# Altium project Rear.PrjPCB (part 2 of 2)

## Sheet Connectors.SchDoc
size A; SheetNumber: 13
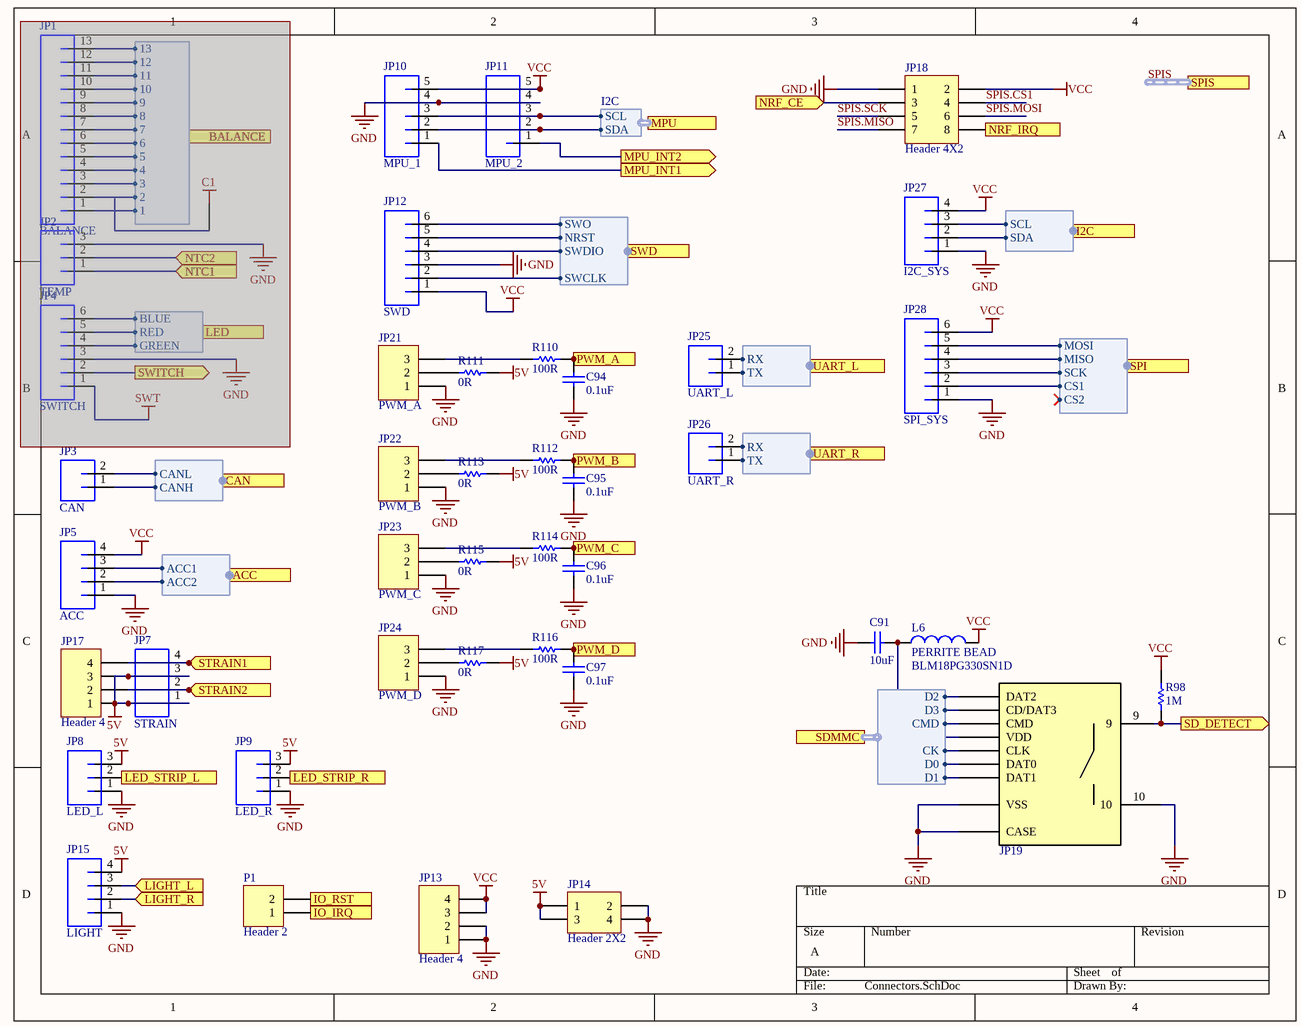
[diagram p7: Connectors.SchDoc]

### Parts
*1  NetTie  [NetTie]  (value not drawn)  (net tie, no BOM)  (masked out: inside a compile mask, not in the netlist)
C91  value 10uF  [C0603[1608X92]]  (hidden comment: 10uF 16V 0603)
C94  value 0.1uF  [C0603[1608X92]]  (hidden comment: 0.1uF 16V 0603)
C95  value 0.1uF  [C0603[1608X92]]  (hidden comment: 0.1uF 16V 0603)
C96  value 0.1uF  [C0603[1608X92]]  (hidden comment: 0.1uF 16V 0603)
C97  value 0.1uF  [C0603[1608X92]]  (hidden comment: 0.1uF 16V 0603)
JP1  BALANCE  [JST-XH-13-PTH-VERT]  (masked out: inside a compile mask, not in the netlist)
JP2  TEMP  [JST-PH-3-PTH-VERT]  (masked out: inside a compile mask, not in the netlist)
JP3  CAN  [JST-PH-2-PTH-VERT]
JP4  SWITCH  [JST-PH-6-PTH-VERT]  (masked out: inside a compile mask, not in the netlist)
JP5  ACC  [JST-PH-4-PTH-VERT]
JP7  STRAIN  [Terminal-3.81-HORZ]
JP8  LED_L  [JST-PH-3-PTH-VERT]
JP9  LED_R  [JST-PH-3-PTH-VERT]
JP10  MPU_1  [JST-PH-5-PTH-VERT]
JP11  MPU_2  [JST-PH-5-PTH-VERT]
JP12  SWD  [MOLEX_5045_6]
JP13  Header 4  [HDR1X4]
JP14  Header 2X2  [HDR2X2]
JP15  LIGHT  [JST-PH-4-PTH-VERT]
JP17  Header 4  [HDR1X4]
JP18  Header 4X2  [HDR2X4]
JP19  MICRO SD TOP MOUNT  [MICRO SD_502570]  (value not drawn)
JP21  PWM_A  [HDR1X3]
JP22  PWM_B  [HDR1X3]
JP23  PWM_C  [HDR1X3]
JP24  PWM_D  [HDR1X3]
JP25  UART_L  [JST-PH-2-PTH-VERT]
JP26  UART_R  [JST-PH-2-PTH-VERT]
JP27  I2C_SYS  [JST-PH-4-PTH-VERT]
JP28  SPI_SYS  [JST-PH-6-PTH-VERT]
L6  Type: PERRITE BEAD  PartNumber: BLM18PG330SN1D  [IND0603]  (hidden comment: 33Ohm)
P1  Header 2  [HDR1X2]
R98  value 1M  [R0603[1608]]  (hidden comment: 1M 5% 0603)
R110  value 100R  [R0603[1608]]  (hidden comment: 100R 1% 0603)
R111  value 0R  [R0603[1608]]  (hidden comment: 0R 1% 0603)
R112  value 100R  [R0603[1608]]  (hidden comment: 100R 1% 0603)
R113  value 0R  [R0603[1608]]  (hidden comment: 0R 1% 0603)
R114  value 100R  [R0603[1608]]  (hidden comment: 100R 1% 0603)
R115  value 0R  [R0603[1608]]  (hidden comment: 0R 1% 0603)
R116  value 100R  [R0603[1608]]  (hidden comment: 100R 1% 0603)
R117  value 0R  [R0603[1608]]  (hidden comment: 0R 1% 0603)

### Ports
ACC (harness Accessory Outputs), BALANCE (harness Balance), CAN (harness CAN Output), I2C (harness I2C), IO_IRQ (out), IO_RST (in), LED (harness LED), LED_STRIP_L (in), LED_STRIP_R (in), LIGHT_L (in), LIGHT_R (in), MPU (harness I2C), MPU_INT1 (out), MPU_INT2 (out), NRF_CE (in), NRF_IRQ (out), NTC1 (in), NTC2 (in), PWM_A (in), PWM_B (in), PWM_C (in), PWM_D (in), SD_DETECT (out), SDMMC (harness SDMMC), SPI (harness SPI), SPIS (harness SPI), STRAIN1 (in), STRAIN2 (in), SWD (harness SWD), SWITCH (out), UART_L (harness USART2), UART_R (harness USART2)

### Harnesses
Accessory Outputs: ACC1, ACC2
CAN Output: CANL, CANH
Balance: 13, 12, 11, 10, 9, 8, 6, 7, 5, 3, 4, 2, 1
I2C: SCL, SDA
SWD: SWCLK, SWDIO, SWO, NRST
LED: RED, BLUE, GREEN
SDMMC: D2, D3, CMD, CK, D0, D1
USART2: RX, TX
SPI: MISO, MOSI, CS1, SCK, CS2

### Nets
5V: JP7.1 JP7.3 JP8.3 JP9.3 JP14.1 JP14.3 JP15.4 JP17.1 JP17.3 R111.2 R113.2 R115.2 R117.2
GND: C91.2 C94.1 C95.1 C96.1 C97.1 JP5.1 JP8.1 JP9.1 JP10.4 JP11.4 JP12.3 JP13.1 JP13.2 JP14.2 JP14.4 JP15.1 JP18.1 JP19.10 JP19.CASE JP19.VSS JP21.1 JP22.1 JP23.1 JP24.1 JP27.1 JP28.1
VCC: JP5.4 JP10.5 JP11.5 JP12.1 JP13.3 JP13.4 JP18.2 JP27.4 JP28.6 L6.2 R98.1
ACC.ACC1: JP5.3 ; port ACC.ACC1
ACC.ACC2: JP5.2 ; port ACC.ACC2
AINP1: JP7.4 JP17.4 ; port STRAIN1
AINP2: JP7.2 JP17.2 ; port STRAIN2
I2C_MPU.SCL: JP10.3 JP11.3 ; port MPU.SCL
I2C_MPU.SDA: JP10.2 JP11.2 ; port MPU.SDA
I2C_SYS.SCL: JP27.3 ; port I2C.SCL
I2C_SYS.SDA: JP27.2 ; port I2C.SDA
LIGHT_L: JP15.3 ; port LIGHT_L
LIGHT_R: JP15.2 ; port LIGHT_R
SD.CK: JP19.CLK ; port SDMMC.CK
SD.CMD: JP19.CMD ; port SDMMC.CMD
SD.D0: JP19.DAT0 ; port SDMMC.D0
SD.D1: JP19.DAT1 ; port SDMMC.D1
SD.D2: JP19.DAT2 ; port SDMMC.D2
SD.D3: JP19.CD/DAT3 ; port SDMMC.D3
SPI2.CS1: JP28.2 ; port SPI.CS1
SPI2.MISO: JP28.4 ; port SPI.MISO
SPI2.MOSI: JP28.5 ; port SPI.MOSI
SPI2.SCK: JP28.3 ; port SPI.SCK
SPIS.CS1: JP18.4
SPIS.MISO: JP18.7
SPIS.MOSI: JP18.6
SPIS.SCK: JP18.5
SWD.NRST: JP12.5 ; port SWD.NRST
SWD.SWCLK: JP12.2 ; port SWD.SWCLK
SWD.SWDIO: JP12.4 ; port SWD.SWDIO
SWD.SWO: JP12.6 ; port SWD.SWO
UART_A.RX: JP25.2 ; port UART_L.RX
UART_A.TX: JP25.1 ; port UART_L.TX
UART_B.RX: JP26.2 ; port UART_R.RX
UART_B.TX: JP26.1 ; port UART_R.TX
NetC91_1: C91.1 JP19.VDD L6.1
NetC94_2: C94.2 R110.2 ; port PWM_A
NetC95_2: C95.2 R112.2 ; port PWM_B
NetC96_2: C96.2 R114.2 ; port PWM_C
NetC97_2: C97.2 R116.2 ; port PWM_D
NetJP3_1: JP3.1 ; port CAN.CANH
NetJP3_2: JP3.2 ; port CAN.CANL
NetJP8_2: JP8.2 ; port LED_STRIP_L
NetJP9_2: JP9.2 ; port LED_STRIP_R
NetJP10_1: JP10.1 ; port MPU_INT1
NetJP11_1: JP11.1 ; port MPU_INT2
NetJP18_3: JP18.3 ; port NRF_CE
NetJP18_8: JP18.8 ; port NRF_IRQ
NetJP19_9: JP19.9 R98.2 ; port SD_DETECT
NetJP21_2: JP21.2 R111.1
NetJP21_3: JP21.3 R110.1
NetJP22_2: JP22.2 R113.1
NetJP22_3: JP22.3 R112.1
NetJP23_2: JP23.2 R115.1
NetJP23_3: JP23.3 R114.1
NetJP24_2: JP24.2 R117.1
NetJP24_3: JP24.3 R116.1
NetP1_1: P1.1 ; port IO_IRQ
NetP1_2: P1.2 ; port IO_RST

### Buses and harness runs
harness SPIS = port SPIS

### Library data of the parts
C91 = CAP_10uF_16V_0603_10%: 10uF 16V 10% 0603 (1608 Metric); PartNumber: GRM188R61C106KAALD; Manufacturer: Murata; TemperatureCoefficient: X5R; Mounting Technology: Surface Mount; PackageReference: 0603; PackageDescription: 0603 (1608 Metric); Voltage: 16V; Tolerance: 10%
C94-C97 = CAP_0.1uF_16V_0603_10%: 0.1uF 16V 10% 0603 (1608 Metric); PartNumber: GCM188R71C104KA37D; Manufacturer: Murata; TemperatureCoefficient: X7R; Mounting Technology: Surface Mount; PackageReference: 0603; PackageDescription: 0603 (1608 Metric); Voltage: 16V; Tolerance: 10%
JP1 = JST_XH_13_VERT: Manufacturer: JST Sales America, Inc.; PartNumber: B13B-XH-A(LF)(SN); Mounting Technology: Through Hole; PackageReference: JST-XH
JP2 JP8 JP9 = JST_PH_3_VERT: Manufacturer: JST Sales America Inc.; PartNumber: B3B-PH-K-S(LF)(SN); Mounting Technology: Through Hole; PackageReference: JST-PH
JP3 JP25 JP26 = JST_PH_2_VERT: Manufacturer: JST Sales America Inc.; PartNumber: B2B-PH-K-S(LF)(SN); Mounting Technology: Through Hole; PackageReference: JST-PH
JP4 JP28 = JST_PH_6_VERT: PartNumber: B6B-PH-K-S(LF)(SN); Manufacturer: JST Sales America Inc.; PackageReference: JST-PH; Mounting Technology: Through Hole
JP5 JP27 = JST_PH_4_VERT: Manufacturer: JST Sales America Inc.; PartNumber: B4B-PH-K-S(LF)(SN); PackageReference: JST-PH; Mounting Technology: Through Hole
JP7 = Terminal_MC 1,5/ 4-G-3,81: PartNumber: 1803293; Manufacturer: Phoenix Contact; MatePart: 1803594; PackageReference: MC; Mounting Technology: Through Hole
JP10 JP11 = JST_PH_5_VERT: Manufacturer: JST Sales America, Inc.; PartNumber: B5B-PH-K-S(LF)(SN); PackageReference: JST-PH; Mounting Technology: Through Hole
JP12 = MOLEX_5045_6: PartNumber: B6B-PH-K-S(LF)(SN); Manufacturer: JST Sales America Inc.; PackageReference: JST-PH; Mounting Technology: Through Hole
JP13 JP17 = Header 4: Header, 4-Pin; LatestRevisionDate: 17-Jul-2002; LatestRevisionNote: Re-released for DXP Platform.; Publisher: Altium Limited
JP14 = Header 2X2: Header, 2-Pin, Dual row; LatestRevisionDate: 17-Jul-2002; LatestRevisionNote: Re-released for DXP Platform.; Publisher: Altium Limited
JP15 = JST_PH_4_VERT: PartNumber: B4B-PH-K-S(LF)(SN); Manufacturer: JST Sales America Inc.; PackageReference: JST-PH; Mounting Technology: Through Hole
JP18 = Header 4X2: Header, 4-Pin, Dual row; LatestRevisionDate: 17-Jul-2002; LatestRevisionNote: Re-released for DXP Platform.; Publisher: Altium Limited
JP19 = MICRO SD_5025: MICRO SD Slot / TOP MOUNT / FRONT; Manufacturer: Molex; PartNumber: 5025700893; Mounting Technology: SMD; PackageReference: Header-1.27mm-2x5
JP21-JP24 = Header 3: Header, 3-Pin; LatestRevisionDate: 17-Jul-2002; LatestRevisionNote: Re-released for DXP Platform.; Publisher: Altium Limited
L6 = PER_33Ohm_3A_0603: 33Ohm 3A 0603 Perrite Bead; Manufacturer: Murata; PackageReference: 0603; PackageDescription: 0603 (1608 metric); Mounting Technology: Surface Mount; Current: 3A; Value: 33Ohm
P1 = Header 2: Header, 2-Pin; LatestRevisionDate: 17-Jul-2002; LatestRevisionNote: Re-released for DXP Platform.; Publisher: Altium Limited
R98 = RES_1M_0603_5%: 1M 0.25W 5% 0603 (1005 Metric); Manufacturer: Panasonic; PartNumber: ERJ-PA3J105V; Tolerance: 5%; Power: 0.25W; Mounting Technology: Surface Mount; PackageReference: 0603; PackageDescription: 0603 (1608 Metric); ComponentLink1Description: Datasheet; ComponentLink1URL: http://www.vishay.com/docs/20043/crcwhpe3.pdf
R110 R112 R114 R116 = RES_100R_0603_1%: 100R 0.25W 1% 0603 (1005 Metric); Manufacturer: Vishay / Dale; PartNumber: CRCW0603100RFKEAHP; Tolerance: 1%; Power: 0.25W; Mounting Technology: Surface Mount; PackageReference: 0603; PackageDescription: 0603 (1608 Metric); ComponentLink1Description: Datasheet; ComponentLink1URL: http://www.vishay.com/docs/20043/crcwhpe3.pdf
R111 R113 R115 R117 = RES_0R_0603_1%: 0R 0.25W 1% 0603 (1005 Metric); Manufacturer: Vishay / Dale; PartNumber: CRCW06030000Z0EAHP; Tolerance: 1%; Power: 0.25W; Mounting Technology: Surface Mount; PackageReference: 0603; PackageDescription: 0603 (1608 Metric); ComponentLink1Description: Datasheet; ComponentLink1URL: http://www.vishay.com/docs/20043/crcwhpe3.pdf

## Sheet USB.SchDoc
size A4
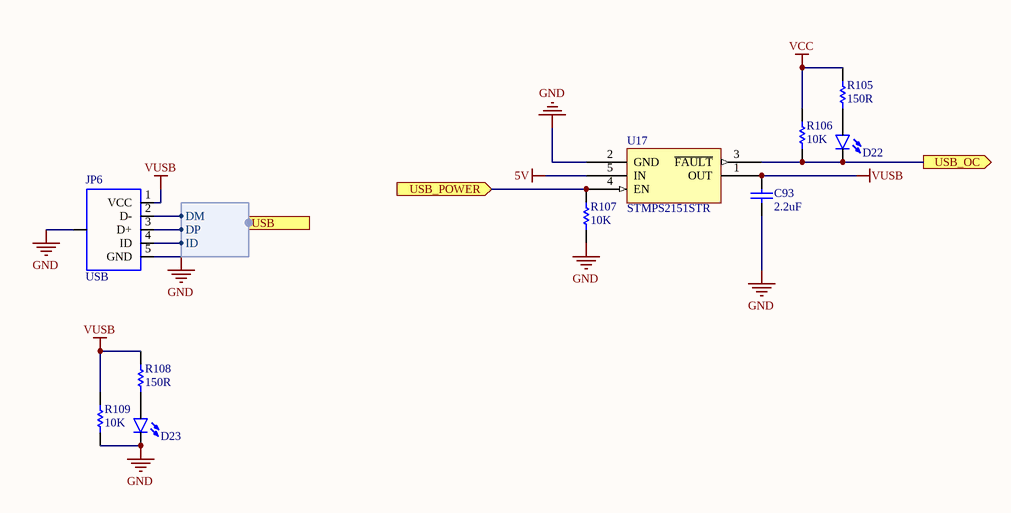
[diagram p8: USB.SchDoc]

### Parts
C93  value 2.2uF  [C1206[3216X160]]  (hidden comment: 2.2uF 16V 1206)
D22  USB_OC  [LED0603]  (value not drawn)
D23  USB_PW  [LED0603]  (value not drawn)
JP6  USB  [USB_MICROB_VERT]
R105  value 150R  [R0603[1608]]  (hidden comment: 150R 1% 0603)
R106  value 10K  [R0603[1608]]  (hidden comment: 10K 1% 0603)
R107  value 10K  [R0603[1608]]  (hidden comment: 10K 1% 0603)
R108  value 150R  [R0603[1608]]  (hidden comment: 150R 1% 0603)
R109  value 10K  [R0603[1608]]  (hidden comment: 10K 1% 0603)
U17  STMPS2151STR  [SOT-23-5L]

### Ports
USB (harness USB), USB_OC (out), USB_POWER (in)

### Harnesses
USB: DM, DP, ID

### Nets
5V: U17.5(IN)
GND: C93.2 D23.C JP6.5(GND) JP6.6(SHIELD) R107.1 R109.1 U17.2(GND)
VCC: R105.2 R106.2
VUSB: C93.1 JP6.1(VCC) R108.2 R109.2 U17.1(OUT)
USB_ID: JP6.4(ID) ; port USB.ID
USB_N: JP6.2(D-) ; port USB.DM
USB_P: JP6.3(D+) ; port USB.DP
NetD22_A: D22.A R105.1
NetD22_C: D22.C R106.1 U17.3(~{FAULT}) ; port USB_OC
NetD23_A: D23.A R108.1
NetR107_2: R107.2 U17.4(EN) ; port USB_POWER

### Library data of the parts
C93 = CAP_2.2uF_16V_1206_10%: 2.2uF 16V 10% X7R 1206 (3216 Metric); PartNumber: C1206C225K4RACAUTO; Manufacturer: KEMET; Mounting Technology: Surface Mount; PackageReference: 1206; PackageDescription: 1206 (3216 Metric); Voltage: 16V; Tolerance: 10%
D22 D23 = LED_0603_GREEN_5mA: PartNumber: LTST-C193TGKT-5A; Manufacturer: Lite-On Inc.; PackageReference: 0603; PackageDescription: 0603 (1608 Metric); Mounting Technology: Surface Mount
JP6 = USB_MICROB_VERT: PartNumber: 614105150721; Manufacturer: Wurth Electronics; Mounting Technology: Through Hole; PackageReference: USB - Micro B
R105 R108 = RES_150R_0603_1%: 150R 0.25W 1% 0603 (1005 Metric); Manufacturer: Vishay / Dale; PartNumber: CRCW0603150RFKEAHP; Tolerance: 1%; Power: 0.25W; Mounting Technology: Surface Mount; PackageReference: 0603; PackageDescription: 0603 (1608 Metric); ComponentLink1Description: Datasheet; ComponentLink1URL: http://www.vishay.com/docs/20043/crcwhpe3.pdf
R106 R107 R109 = RES_10K_0603_1%: 10K 0.25W 1% 0603 (1005 Metric); Manufacturer: Vishay / Dale; PartNumber: CRCW060310K0FKEAHP; Tolerance: 1%; Power: 0.25W; Mounting Technology: Surface Mount; PackageReference: 0603; PackageDescription: 0603 (1608 Metric); ComponentLink1Description: Datasheet; ComponentLink1URL: http://www.vishay.com/docs/20065/rcse3.pdf
U17 = STMPS2141STR

## Sheet CurrentSense.SchDoc
size A; SheetNumber: 8
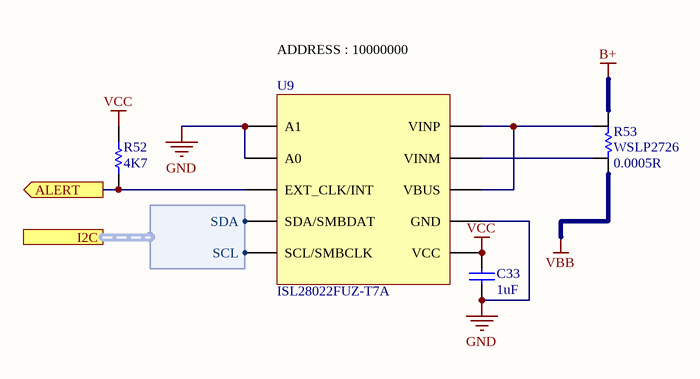
[diagram p9: CurrentSense.SchDoc]

### Parts
C33  value 1uF  [C0603[1608X92]]  (hidden comment: 1uF 6.3V 0603)
R52  value 4K7  [R0603[1608]]  (hidden comment: 4K7 1% 0603)
R53  WSLP2726  value 0.0005R  [WSL2726]
U9  ISL28022FUZ-T7A  [MSOP-10]

### Ports
ALERT (out), I2C (harness I2C)

### Harnesses
I2C: SCL, SDA

### Nets
B+: R53.2
GND: C33.1 U9.1(A1) U9.2(A0) U9.7(GND)
VBB: R53.1
VCC: C33.2 R52.2 U9.6(VCC)
ALERT: R52.1 U9.3(EXT_CLK/INT) ; port ALERT
I2C_SYS.SCL: U9.5(SCL/SMBCLK) ; port I2C.SCL
I2C_SYS.SDA: U9.4(SDA/SMBDAT) ; port I2C.SDA
NetR53_3: R53.3 U9.9(VINM)
NetR53_4: R53.4 U9.8(VBUS) U9.10(VINP)

### Notes on the sheet
- ADDRESS : 10000000

### Library data of the parts
C33 = CAP_1uF_6.3V_0603_10%: 1uF 6.3V 10% 0603 (1608 Metric); PartNumber: GRM188R60J105KA01D; Manufacturer: Murata; TemperatureCoefficient: X5R; Mounting Technology: Surface Mount; PackageReference: 0603; PackageDescription: 0603 (1608 Metric); Voltage: 6.3V; Tolerance: 10%
R52 = RES_4K7_0603_1%: 4K7 0.25W 1% 0603 (1005 Metric); Manufacturer: Vishay / Dale; PartNumber: CRCW06034K70FKEAHP; Tolerance: 1%; Power: 0.25W; Mounting Technology: Surface Mount; PackageReference: 0603; PackageDescription: 0603 (1608 Metric); ComponentLink1Description: Datasheet; ComponentLink1URL: http://www.vishay.com/docs/20043/crcwhpe3.pdf
R53 = WSLP2726: Current Sense Resistor, 0.0005R; PartNumber: WSLP2726L5000FEA; Manufacturer: Vishay / Dale; Power: 7W; Tolerance: 1%; PackageReference: 2726; Mounting Technology: Surface Mount
U9 = ISL28022FUZ-T7A: Manufacturer: Intersil; PartNumber: ISL28022FUZ-T7A; Mounting Technology: Surface Mount; PackageReference: MSOP-10

## Nets that join several sheets
5V: 3V3 (11 pins), ADS1257 (5 pins), Connectors (13 pins), USB (U17.5)
GND: CAN (C32.2 U8.2), Bluetooth (R84.2 U13.1), 3V3 (32 pins), Flash (C40.2 U11.4), ADS1257 (20 pins), MCU (30 pins), Connectors (26 pins), USB (7 pins), CurrentSense (C33.1 U9.1 U9.2 U9.7)
REF: 3V3 (C72.1 U15.6 U15.7), ADS1257 (C80.1 C81.1 C82.1 U16.1)
VBB: 3V3 (13 pins), CurrentSense (R53.1)
VCC: CAN (C32.1 U8.3), Bluetooth (U13.15 U13.24), 3V3 (5 pins), Flash (C40.1 R61.2 U11.8), ADS1257 (5 pins), MCU (38 pins), Connectors (11 pins), USB (R105.2 R106.2), CurrentSense (C33.2 R52.2 U9.6)
VUSB: 3V3 (D11.2 D15.1), MCU (U2.68), USB (5 pins)
AINP1: ADS1257 (R83.2 R119.2), Connectors (JP7.4 JP17.4)
AINP2: ADS1257 (R92.2 R121.2), Connectors (JP7.2 JP17.2)
ALERT: MCU (U2.85), CurrentSense (R52.1 U9.3)
I2C_SYS.SCL: Connectors (JP27.3), CurrentSense (U9.5)
I2C_SYS.SDA: Connectors (JP27.2), CurrentSense (U9.4)
LIGHT_L: MCU (U2.62), Connectors (JP15.3)
LIGHT_R: MCU (U2.61), Connectors (JP15.2)
NetC94_2: MCU (U2.22), Connectors (C94.2 R110.2)
NetC95_2: MCU (U2.23), Connectors (C95.2 R112.2)
NetC96_2: MCU (U2.24), Connectors (C96.2 R114.2)
NetC97_2: MCU (U2.25), Connectors (C97.2 R116.2)
NetD22_C: MCU (U2.77), USB (D22.C R106.1 U17.3)
NetJP3_1: CAN (R58.2 U8.7), Connectors (JP3.1)
NetJP3_2: CAN (R58.1 U8.6), Connectors (JP3.2)
NetJP8_2: MCU (U2.35), Connectors (JP8.2)
NetJP9_2: MCU (U2.34), Connectors (JP9.2)
NetJP10_1: MCU (U2.59), Connectors (JP10.1)
NetJP11_1: MCU (U2.60), Connectors (JP11.1)
NetJP18_3: MCU (U2.33), Connectors (JP18.3)
NetJP18_8: MCU (U2.28), Connectors (JP18.8)
NetJP19_9: MCU (U2.84), Connectors (JP19.9 R98.2)
NetP1_1: MCU (U2.55), Connectors (P1.1)
NetP1_2: MCU (U2.56), Connectors (P1.2)
NetR93_1: ADS1257 (R93.1 Y1.1), MCU (U2.51)
NetR107_2: MCU (U2.67), USB (R107.2 U17.4)
NetR118_1: ADS1257 (R118.1), MCU (U2.40)
SPI2.MISO: Flash (U11.2), Connectors (JP28.4)
SPI2.MOSI: Flash (U11.5), Connectors (JP28.5)
SPI2.SCK: Flash (U11.6), Connectors (JP28.3)
USB_ID: MCU (U2.69), USB (JP6.4)
USB_N: MCU (R11.1), USB (JP6.2)
USB_P: MCU (R12.1), USB (JP6.3)